# Altium schematic sheet [10] Peripheral.SchDoc: ARS Camera REV01 Peripherals (part 2 of 2)
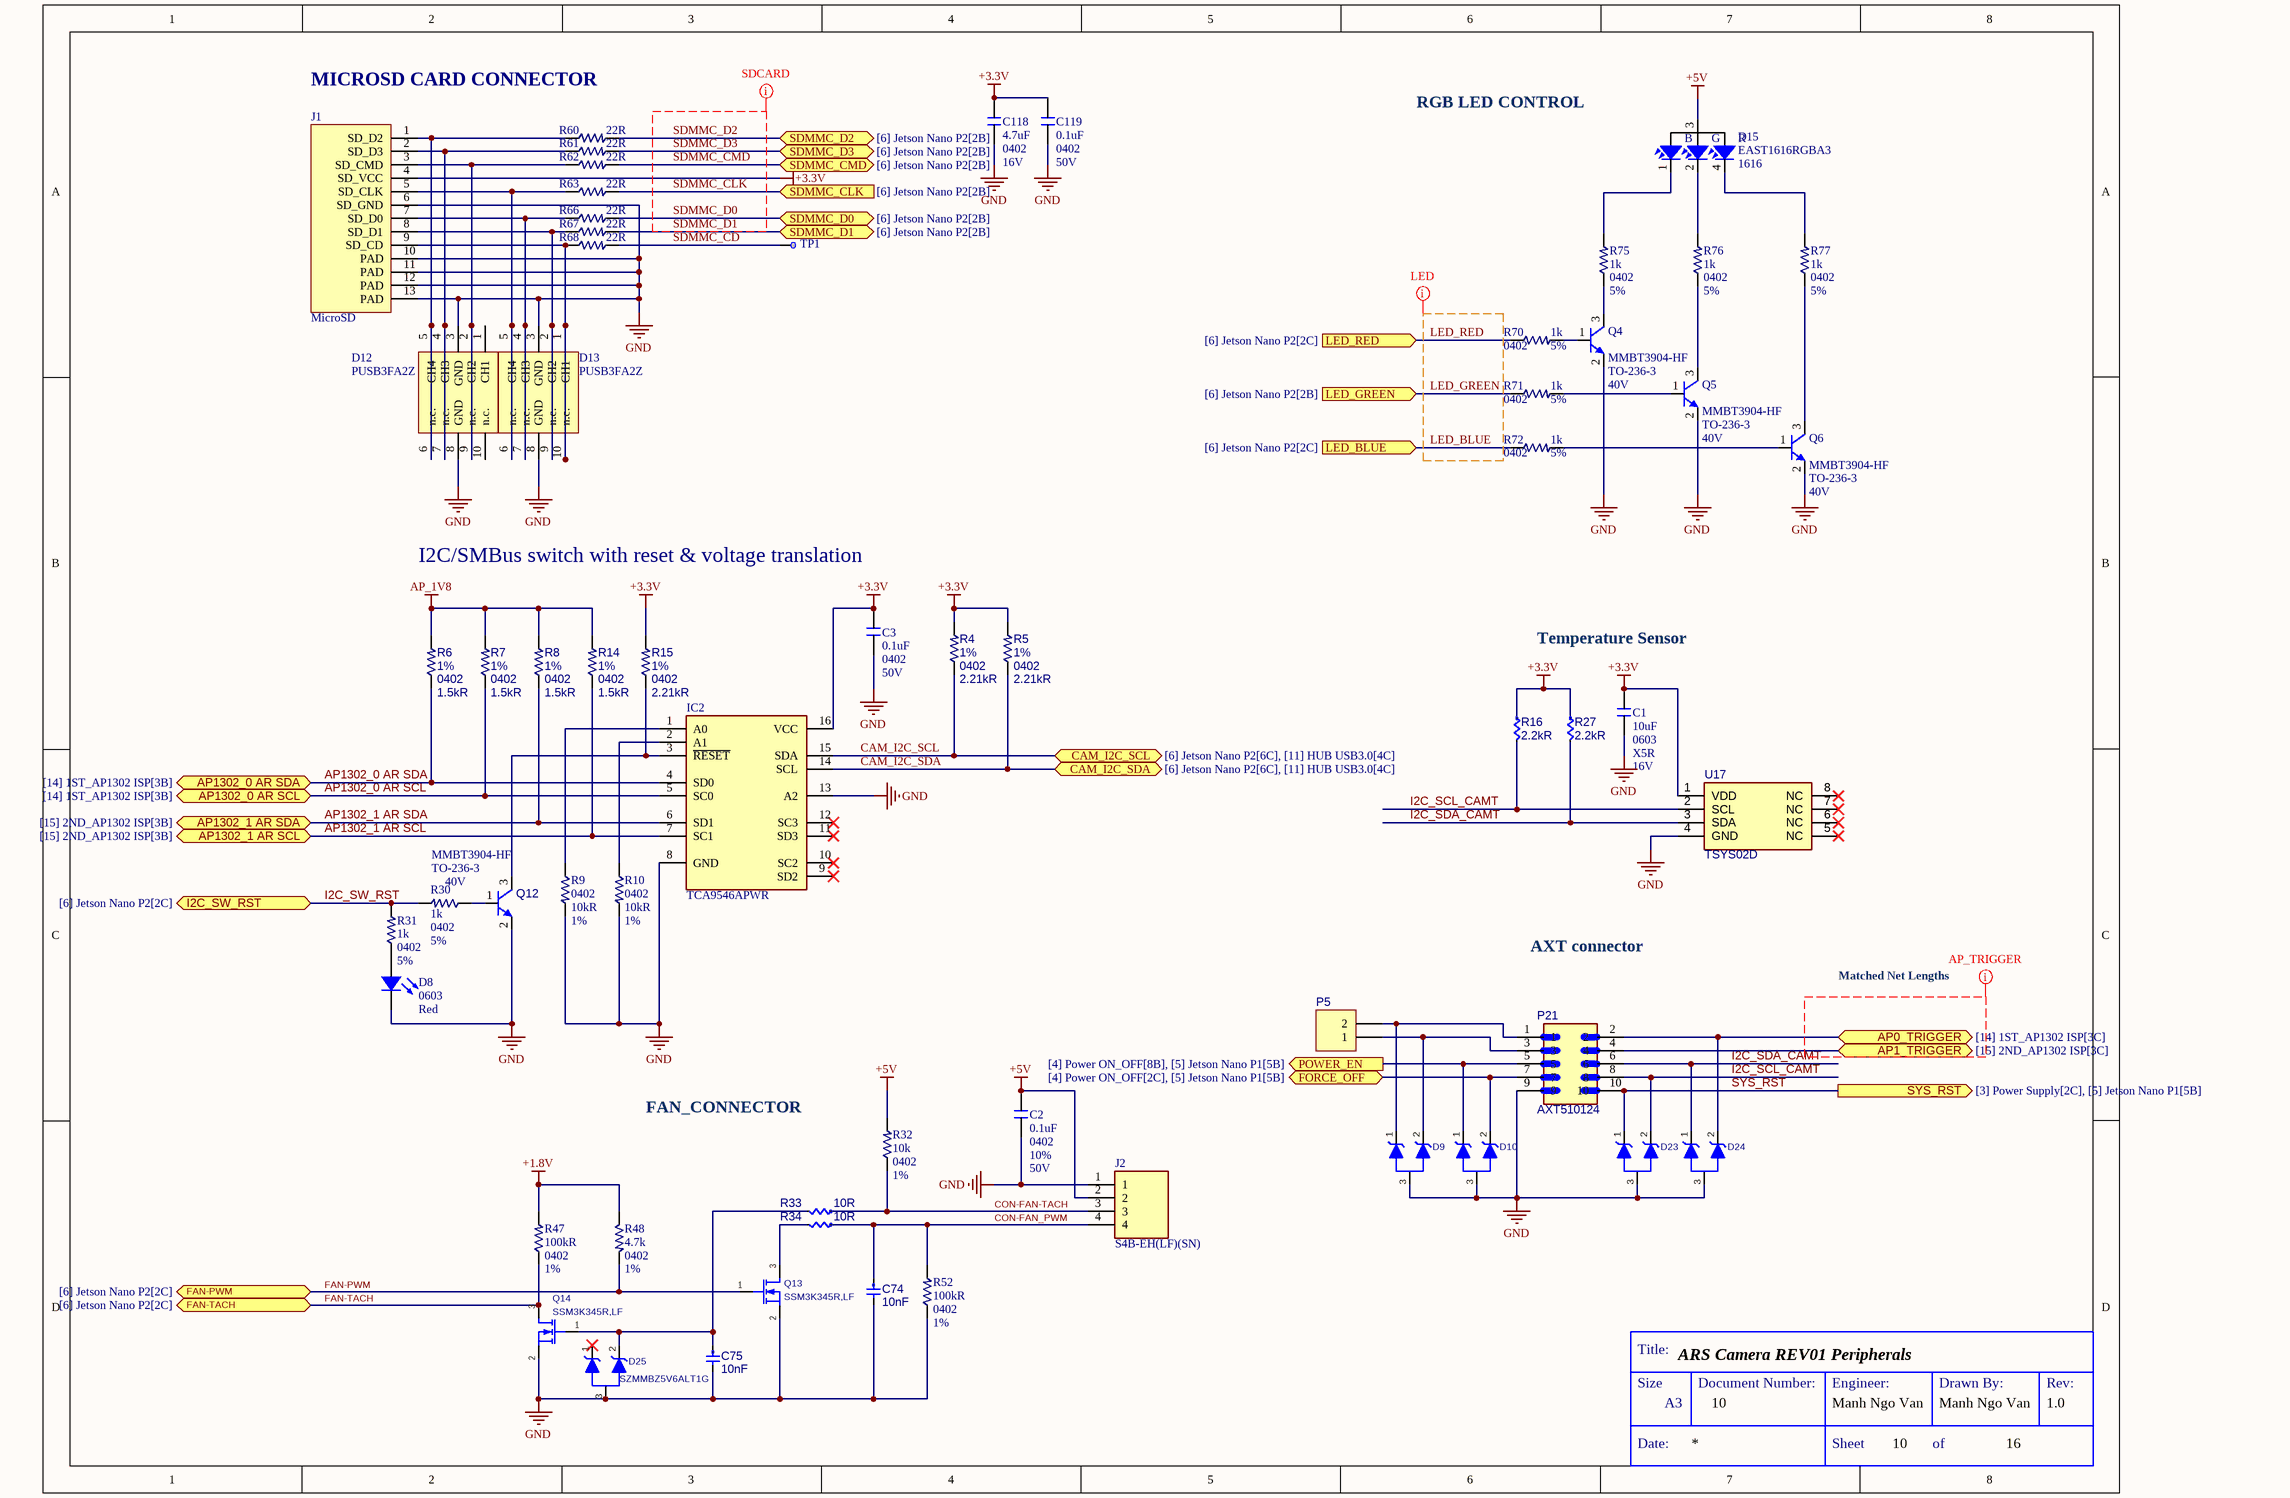
[diagram p1: [10] Peripheral.SchDoc]

## Library data of the parts
C1 = CAP_CER: CAP CER 10UF 16V X5R 0603; Manufacturer: Taiyo Yuden; Manufacturer Part Number: EMK107BBJ106MA-T; Tolerance: 20%; Supplier 1: Digi-Key; Supplier Part Number 1: 587-3238-1-ND; RoHS: Yes; Category: Ceramic Capacitors; Stock 1: 599529; Pricing 1: 1=0.34000, 10=0.23400, 50=0.16400, 100=0.14060, 500=0.10544, 1000=0.08903 (USD); Mount: Surface Mount; Case Code (Metric): 1608; Case Code (Imperial): 0603; Min Operating Temperature: -55°C; Max Operating Temperature: 85°C; Capacitance: 10uF; Packaging: Tape and Reel; Voltage Rating: 16V; Package Quantity: 1; Termination: SMD/SMT; Series: M; Construction: Flat; Length: 0.063inch; Width: 0.031inch; Height: 0.8mm; Thickness: 0.031inch; RoHS Compliant: Yes; REACH SVHC: Unknown; Halogen Free: Halogen Free; ComponentLink1URL: https://datasheet.ciiva.com/6259/emk107bbj106ma-t-6259169.pdf?src-supplier=Digi-Key; ComponentLink1Description: https://datasheet.ciiva.com/6259/emk107bbj106ma-t-6259169.pdf?src-supplier=Digi-Key; ComponentLink2URL: https://datasheet.ciiva.com/15920/3emk107bbj106ma-t-15920482.pdf?src-supplier=Onlinecomponents.com; ComponentLink2Description: https://datasheet.ciiva.com/15920/3emk107bbj106ma-t-15920482.pdf?src-supplier=Onlinecomponents.com; ComponentLink3URL: https://datasheet.ciiva.com/34372/463emk107bbj106ma-t-34372674.pdf?src-supplier=Onlinecomponents.com; ComponentLink3Description: https://datasheet.ciiva.com/34372/463emk107bbj106ma-t-34372674.pdf?src-supplier=Onlinecomponents.com; ComponentLink4URL: https://datasheet.ciiva.com/6259/emk107bbj106ma-t-6259164.pdf?src-supplier=Digi-Key; ComponentLink4Description: https://datasheet.ciiva.com/6259/emk107bbj106ma-t-6259164.pdf?src-supplier=Digi-Key; ComponentLink5URL: https://datasheet.ciiva.com/6259/emk107bbj106ma-t-6259167.pdf?src-supplier=Digi-Key; ComponentLink5Description: https://datasheet.ciiva.com/6259/emk107bbj106ma-t-6259167.pdf?src-supplier=Digi-Key; ComponentLink6URL: https://datasheet.ciiva.com/13168/mlcc01-e-13168735.pdf?src-supplier=Mouser; ComponentLink6Description: https://datasheet.ciiva.com/13168/mlcc01-e-13168735.pdf?src-supplier=Mouser
C2 = CAP_CER: CAP CER 0.1UF 50V X7R 0402; Manufacturer: Murata; Manufacturer Part Number: GRM155R71H104KE14D; Material: Ceramic; Capacitance: 100nF; Dissipation Factor: 0.025%; ComponentLink1URL: https://datasheet.ciiva.com/25741/cl10b104kb8nnnl-25741341.pdf?src-supplier=Digi-Key; ComponentLink1Description: https://datasheet.ciiva.com/25741/cl10b104kb8nnnl-25741341.pdf?src-supplier=Digi-Key; ComponentLink2URL: https://datasheet.ciiva.com/26838/getdatasheetpartid-357523-26838415.pdf?src-supplier=Verical; ComponentLink2Description: https://datasheet.ciiva.com/26838/getdatasheetpartid-357523-26838415.pdf?src-supplier=Verical; Supplier 1: Digi-Key; Supplier Part Number 1: 490-10700-1-ND; Stock 1: 2282266; Pricing 1: 1 = 0.10000, 10 = 0.04600, 100 = 0.02050, 500 = 0.01464, 1000 = 0.01150, 2500 = 0.01045, 5000 = 0.00961 (USD); RoHS: Yes; Mount: Surface Mount; Weight: 0.000212oz; Case Code (Metric): 1005; Case Code (Imperial): 0402; Dielectric Material: Ceramic; Min Operating Temperature: -55°C; Max Operating Temperature: 125°C; Packaging: Tape and Reel; Dielectric: X7R; Voltage Rating: 50V; Termination: SMD/SMT; Composition: Ceramic; Voltage Rating (DC): 50V; Package Quantity: 10000; Length: 1mm; Height: 0.5mm; Width: 0.5mm; Thickness: 0.022inch; Depth: 0.5mm; REACH SVHC: No SVHC; Lead Free: Lead Free; ComponentLink3URL: http://www.farnell.com/datasheets/2079156.pdf?src-supplier=Farnell; ComponentLink3Description: http://www.farnell.com/datasheets/2079156.pdf?src-supplier=Farnell; ComponentLink4URL: http://www.mouser.com/ds/2/281/c02e-2905.pdf?src-supplier=Mouser; ComponentLink4Description: http://www.mouser.com/ds/2/281/c02e-2905.pdf?src-supplier=Mouser; ComponentLink5URL: http://components.arrow.com/part/dataview/0323_07030614?src-supplier=Arrow+Europe; ComponentLink5Description: http://components.arrow.com/part/dataview/0323_07030614?src-supplier=Arrow+Europe; ComponentLink6URL: https://search.murata.co.jp/Ceramy/image/img/A01X/G101/ENG/GRM155R71H104KE14-01.pdf?src-supplier=Digi-Key; ComponentLink6Description: https://search.murata.co.jp/Ceramy/image/img/A01X/G101/ENG/GRM155R71H104KE14-01.pdf?src-supplier=Digi-Key; ComponentLink7URL: http://psearch.en.murata.com/capacitor/product/GRM155R71H104KE14%23.pdf?src-supplier=Avnet; ComponentLink7Description: http://psearch.en.murata.com/capacitor/product/GRM155R71H104KE14%23.pdf?src-supplier=Avnet; ComponentLink8URL: http://www.farnell.com/datasheets/2079156.pdf?src-supplier=Element14; ComponentLink8Description: http://www.farnell.com/datasheets/2079156.pdf?src-supplier=Element14; ComponentLink9URL: http://www.farnell.com/datasheets/2079156.pdf?src-supplier=Newark; ComponentLink9Description: http://www.farnell.com/datasheets/2079156.pdf?src-supplier=Newark
C3 C119 = CAP_CER: CAP CER 0.1UF 50V X7R 0402; Manufacturer: Murata; Manufacturer Part Number: GRM155R71H104KE14D; Material: Ceramic; Tolerance: 10%; Capacitance: 100nF; Dissipation Factor: 0.025%; ComponentLink1URL: https://datasheet.ciiva.com/25741/cl10b104kb8nnnl-25741341.pdf?src-supplier=Digi-Key; ComponentLink1Description: https://datasheet.ciiva.com/25741/cl10b104kb8nnnl-25741341.pdf?src-supplier=Digi-Key; ComponentLink2URL: https://datasheet.ciiva.com/26838/getdatasheetpartid-357523-26838415.pdf?src-supplier=Verical; ComponentLink2Description: https://datasheet.ciiva.com/26838/getdatasheetpartid-357523-26838415.pdf?src-supplier=Verical; Supplier 1: Digi-Key; Supplier Part Number 1: 490-10700-1-ND; Stock 1: 2282266; Pricing 1: 1 = 0.10000, 10 = 0.04600, 100 = 0.02050, 500 = 0.01464, 1000 = 0.01150, 2500 = 0.01045, 5000 = 0.00961 (USD); RoHS: Yes; Mount: Surface Mount; Weight: 0.000212oz; Case Code (Metric): 1005; Dielectric Material: Ceramic; Min Operating Temperature: -55°C; Max Operating Temperature: 125°C; Packaging: Tape and Reel; Dielectric: X7R; Voltage Rating: 50V; Termination: SMD/SMT; Composition: Ceramic; Voltage Rating (DC): 50V; Package Quantity: 10000; Length: 1mm; Height: 0.5mm; Width: 0.5mm; Thickness: 0.022inch; Depth: 0.5mm; REACH SVHC: No SVHC; Lead Free: Lead Free; ComponentLink3URL: http://www.farnell.com/datasheets/2079156.pdf?src-supplier=Farnell; ComponentLink3Description: http://www.farnell.com/datasheets/2079156.pdf?src-supplier=Farnell; ComponentLink4URL: http://www.mouser.com/ds/2/281/c02e-2905.pdf?src-supplier=Mouser; ComponentLink4Description: http://www.mouser.com/ds/2/281/c02e-2905.pdf?src-supplier=Mouser; ComponentLink5URL: http://components.arrow.com/part/dataview/0323_07030614?src-supplier=Arrow+Europe; ComponentLink5Description: http://components.arrow.com/part/dataview/0323_07030614?src-supplier=Arrow+Europe; ComponentLink6URL: https://search.murata.co.jp/Ceramy/image/img/A01X/G101/ENG/GRM155R71H104KE14-01.pdf?src-supplier=Digi-Key; ComponentLink6Description: https://search.murata.co.jp/Ceramy/image/img/A01X/G101/ENG/GRM155R71H104KE14-01.pdf?src-supplier=Digi-Key; ComponentLink7URL: http://psearch.en.murata.com/capacitor/product/GRM155R71H104KE14%23.pdf?src-supplier=Avnet; ComponentLink7Description: http://psearch.en.murata.com/capacitor/product/GRM155R71H104KE14%23.pdf?src-supplier=Avnet; ComponentLink8URL: http://www.farnell.com/datasheets/2079156.pdf?src-supplier=Element14; ComponentLink8Description: http://www.farnell.com/datasheets/2079156.pdf?src-supplier=Element14; ComponentLink9URL: http://www.farnell.com/datasheets/2079156.pdf?src-supplier=Newark; ComponentLink9Description: http://www.farnell.com/datasheets/2079156.pdf?src-supplier=Newark
  C3: Case Code (Imperial): 0402
  C119: Case/Package: 0402
C74 C75 = CMP-01521-1: CAP CER 10000PF 25V X7R 0402; Manufacturer 1: Würth Elektronik; Tolerance: 10%; RoHS Compliant: Yes; Thickness: 0.022inch; Case Code (Imperial): 0402; Length: 0.039inch; Width: 0.02inch; Mount: Surface Mount; Voltage Rating: 25V; Case/Package: 0402; Min Operating Temperature: -55°C; Max Operating Temperature: 125°C; Case Code (Metric): 1005; Manufacturer Part Number 1: 885012205050; Packaging: Tape and Reel
C118 = CAP_CER: CAP CER 4.7UF 16V X5R 0402; Manufacturer: Samsung; Manufacturer Part Number: CL05A475MO5NUNC; Tolerance: 20%; ComponentLink1URL: https://datasheet.ciiva.com/25786/cl05a475mp5nrnc-25786963.pdf?src-supplier=Digi-Key; ComponentLink1Description: https://datasheet.ciiva.com/25786/cl05a475mp5nrnc-25786963.pdf?src-supplier=Digi-Key; ComponentLink2URL: https://datasheet.ciiva.com/16437/cl05b104kq5nnnc-16437353.pdf?src-supplier=Future+Electronics; ComponentLink2Description: https://datasheet.ciiva.com/16437/cl05b104kq5nnnc-16437353.pdf?src-supplier=Future+Electronics; Supplier 1: Digi-Key; Supplier Part Number 1: 1276-6836-6-ND; Stock 1: 1677309; Pricing 1: 1 = 0.45000, 10 = 0.32100, 100 = 0.21130, 500 = 0.15656, 1000 = 0.13307, 2500 = 0.12524, 5000 = 0.11741 (USD); RoHS: Yes; Mount: Surface Mount; Case Code (Imperial): 0402; Case Code (Metric): 1005; Min Operating Temperature: -55°C; Max Operating Temperature: 85°C; Packaging: Tape and Reel; Capacitance: 4.7uF; Length: 0.039inch; Width: 0.02inch; Thickness: 0.022inch; ComponentLink3URL: http://www.farnell.com/datasheets/2710653.pdf?src-supplier=Farnell; ComponentLink3Description: http://www.farnell.com/datasheets/2710653.pdf?src-supplier=Farnell; ComponentLink4URL: http://www.farnell.com/datasheets/2710653.pdf?src-supplier=Newark; ComponentLink4Description: http://www.farnell.com/datasheets/2710653.pdf?src-supplier=Newark; ComponentLink5URL: http://www.samsungsem.com/kr/support/product-search/mlcc/CL05A475MO5NUNC.jsp?src-supplier=Digi-Key; ComponentLink5Description: http://www.samsungsem.com/kr/support/product-search/mlcc/CL05A475MO5NUNC.jsp?src-supplier=Digi-Key
D8 = Led: LED RED CLEAR CHIP SMD; Manufacturer 1: Vishay Lite-On; Lens Color: Colorless; Lens Style: Diffused,Colorless,Rectangular,Clear; Forward Voltage: 1.8V; Viewing Angle: 130°; Forward Current: 20mA; Luminous Intensity: 10mcd; Dominant Wavelength: 638nm; Test Current: 10mA; Number of Elements: 1; Power Dissipation: 62.5mW; Wavelength: 660nm; Reverse Voltage: 5V; Power Rating: 100mW; Supplier 1: Digi-Key; Supplier Part Number 1: 160-1181-1-ND; Manufacturer Part Number 1: LTST-C190CKT; RoHS: Yes; Category: LEDs; Stock 1: 143500; Pricing 1: 1=0.30000 (USD); Mount: Surface Mount; Number of Pins: 2; Case Code (Metric): 1608; Case Code (Imperial): 0603; Min Operating Temperature: -30°C; Max Operating Temperature: 85°C; Packaging: Tape and Reel; Package Quantity: 1; Illumination Color: Red; Lens Transparency: Clear; Number of LEDs: 1; Max Power Dissipation: 100mW; Length: 1.6mm; Width: 0.8mm; Height: 0.8mm; Depth: 0.8mm; Radiation Hardening: No; Lead Free: Lead Free; RoHS Compliant: Yes; ComponentLink1URL: https://datasheet.ciiva.com/2110/ltst-c190ckt-2110129.pdf?src-supplier=Digi-Key; ComponentLink1Description: https://datasheet.ciiva.com/2110/ltst-c190ckt-2110129.pdf?src-supplier=Digi-Key; ComponentLink2URL: https://datasheet.ciiva.com/15201/getdatasheetpartid-245581-15201387.pdf?src-supplier=Verical; ComponentLink2Description: https://datasheet.ciiva.com/15201/getdatasheetpartid-245581-15201387.pdf?src-supplier=Verical; ComponentLink3URL: https://datasheet.ciiva.com/11773/0900766b80dc029f-11773615.pdf?src-supplier=RSComponents; ComponentLink3Description: https://datasheet.ciiva.com/11773/0900766b80dc029f-11773615.pdf?src-supplier=RSComponents; ComponentLink4URL: https://datasheet.ciiva.com/12400/lite-on-ltst-c190ckt-187378-12400679.pdf?src-supplier=Mouser; ComponentLink4Description: https://datasheet.ciiva.com/12400/lite-on-ltst-c190ckt-187378-12400679.pdf?src-supplier=Mouser; ComponentLink5URL: https://datasheet.ciiva.com/16287/lite-on20ltst-c190ckt-16287002.pdf?src-supplier=Future+Electronics; ComponentLink5Description: https://datasheet.ciiva.com/16287/lite-on20ltst-c190ckt-16287002.pdf?src-supplier=Future+Electronics; ComponentLink6URL: https://datasheet.ciiva.com/2110/ltst-c190ckt-2110131.pdf?src-supplier=Digi-Key; ComponentLink6Description: https://datasheet.ciiva.com/2110/ltst-c190ckt-2110131.pdf?src-supplier=Digi-Key; ComponentLink7URL: https://datasheet.ciiva.com/2110/ltst-c190ckt-2110130.pdf?src-supplier=Digi-Key; ComponentLink7Description: https://datasheet.ciiva.com/2110/ltst-c190ckt-2110130.pdf?src-supplier=Digi-Key
D9 D10 D23-D25 = CMP-00699-1: TVS DIODE 3V 8V SOT23-3; Manufacturer 1: ON Semiconductor; Peak Pulse Power: 24W; Test Current: 20mA; Breakdown Voltage: 5.32V; ESD Protection: Yes; Number of Unidirectional Channels: 2; Element Configuration: Common Anode; Polarity: Unidirectional; Max Breakdown Voltage: 5.88V; Leakage Current: 5uA; Direction: Unidirectional,Bidirectional; Power Line Protection: No; Max Surge Current: 3A; Composition: Zener; Max Power Dissipation: 24W; Case/Package: SOT-23-3; Number of Pins: 3; Termination: SMD/SMT; Packaging: Tape and Reel; Min Operating Temperature: -55°C; Depth: 1.3mm; Number of Channels: 2; Reverse Standoff Voltage: 3V; Working Voltage: 3V; Manufacturer Part Number 1: SZMMBZ5V6ALT1G; Clamping Voltage: 8V; Max Reverse Leakage Current: 5uA; Lead Free: Lead Free; Power Dissipation: 24W; Height: 1.01mm; Width: 1.4mm; Min Breakdown Voltage: 5.32V; Package Quantity: 1; Radiation Hardening: No; Max Operating Temperature: 150°C; Operating Supply Voltage: 3V; Peak Pulse Current: 3A; Length: 2.9mm
D12 D13 = PUSB3FA2Z: ESD Suppressors / TVS Diodes PUSB3FA2 XSON10; Manufacturer 1: Nexperia; Supplier 1: Digi-Key; Manufacturer Part Number 1: PUSB3FA2Z; RoHS: No; Stock 1: 355; Pricing 1: 1=0.33000, 10=0.25600, 100=0.15390, 500=0.14250, 1000=0.09690, 2000=0.08921 (USD); ComponentLink1URL: https://assets.nexperia.com/documents/data-sheet/PUSB3FA2.pdf?src-supplier=Digi-Key; ComponentLink1Description: https://assets.nexperia.com/documents/data-sheet/PUSB3FA2.pdf?src-supplier=Digi-Key; Supplier Part Number 1: 1727-7813-1-ND
D15 = RGB LED: LED RGB CLEAR 4SMD; Manufacturer: Everlight; Color: Blue,Green,Red; Lens Color: Colorless; Lens Style: Flat; Element Configuration: Common Anode; Forward Voltage: 2.8V; Test Current: 5mA; Viewing Angle: 120°; Lens Size: 1.1mm; ComponentLink1URL: http://components.arrow.com/part/dataview/45774816S9812950N1331?src-supplier=Arrow+Electronics; ComponentLink1Description: http://components.arrow.com/part/dataview/45774816S9812950N1331?src-supplier=Arrow+Electronics; ComponentLink2URL: http://components.arrow.com/part/dataview/0323_04169278?src-supplier=Arrow+Europe; ComponentLink2Description: http://components.arrow.com/part/dataview/0323_04169278?src-supplier=Arrow+Europe; ComponentLink3URL: http://optoelectronics.liteon.com/ko-kr/api/DwonloadFileHandler.ashx?txtSpecNo=DS22-2005-062&txtPartNo=LTST-S310F3WT&src-supplier=Avnet; ComponentLink3Description: http://optoelectronics.liteon.com/ko-kr/api/DwonloadFileHandler.ashx?txtSpecNo=DS22-2005-062&txtPartNo=LTST-S310F3WT&src-supplier=Avnet; ComponentLink4URL: http://optoelectronics.liteon.com/en-us/product/detail.aspx?txtSpecNo=DS22-2005-062&txtPartNo=LTST-S310F3WT&src-supplier=Mouser; ComponentLink4Description: http://optoelectronics.liteon.com/en-us/product/detail.aspx?txtSpecNo=DS22-2005-062&txtPartNo=LTST-S310F3WT&src-supplier=Mouser; Supplier 1: Digi-Key; Supplier Part Number 1: 1080-1550-1-ND; Manufacturer Part Number: EAST1616RGBA3; Stock 1: 68555; Pricing 1: 1 = 0.47000, 10 = 0.28800, 100 = 0.16580, 1000 = 0.12974 (USD); RoHS: Yes; Mount: Surface Mount; Case/Package: 0606; Case Code (Imperial): 0606; Packaging: Cut Tape; Lens Transparency: Clear; Length: 1.6mm; Width: 1.6mm; Height: 0.45mm; Lead Free: Lead Free; RoHS Compliant: Yes; ComponentLink5URL: https://everlightamericas.com/index.php?controller=attachment&id_attachment=1010&src-supplier=Digi-Key; ComponentLink5Description: https://everlightamericas.com/index.php?controller=attachment&id_attachment=1010&src-supplier=Digi-Key
IC2 = TCA9546APWR: 4-channel 1.65- to 5.5-V I2C/SMBus switch with reset & voltage translation 16-TSSOP -40 to 85; Manufacturer 1: Texas Instruments; Supply Type: Single; Propagation Delay: 1ns; Independent Circuits: 1; Supplier 1: Digi-Key; Manufacturer Part Number 1: TCA9546APWR; Stock 1: 0; Pricing 1: 1=1.74000, 10=1.56500, 25=1.47600, 100=1.25760, 250=1.18084, 500=1.03324, 1000=0.97475 (USD); RoHS: Yes; Mount: Surface Mount; Case/Package: TSSOP; Number of Pins: 16; Weight: 0.006102oz; Contact Plating: Gold; Min Operating Temperature: -40°C; Max Operating Temperature: 85°C; Packaging: Cut Tape; Package Quantity: 2000; Series: TCA9546A; Lead Free: Lead Free; RoHS Compliant: Yes; ComponentLink1URL: http://www.ti.com/lit/ds/symlink/tca9546a.pdf?src-supplier=Digi-Key; ComponentLink1Description: http://www.ti.com/lit/ds/symlink/tca9546a.pdf?src-supplier=Digi-Key; ComponentLink2URL: http://www.ti.com/general/docs/lit/getliterature.tsp?genericPartNumber=TCA9546A&&fileType=pdf&src-supplier=Avnet; ComponentLink2Description: http://www.ti.com/general/docs/lit/getliterature.tsp?genericPartNumber=TCA9546A&&fileType=pdf&src-supplier=Avnet; ComponentLink3URL: http://www.ti.com/lit/gpn/tca9546a?src-supplier=Mouser; ComponentLink3Description: http://www.ti.com/lit/gpn/tca9546a?src-supplier=Mouser; ComponentLink4URL: http://www.ti.com/lit/ds/symlink/tca9546a.pdf?src-supplier=Farnell; ComponentLink4Description: http://www.ti.com/lit/ds/symlink/tca9546a.pdf?src-supplier=Farnell; ComponentLink5URL: http://www.ti.com/lit/ds/symlink/tca9546a.pdf?src-supplier=Newark; ComponentLink5Description: http://www.ti.com/lit/ds/symlink/tca9546a.pdf?src-supplier=Newark; Supplier Part Number 1: 296-40578-1-ND
J1 = uSD_TFv3: MICROSD TF PUSH CONNECTOR; Manufacturer: SHOU HAN; Manufacturer Part Number: TF PUSH; Supplier 1: LCSC; Supplier Part Number 1: C393941
J2 = S4B-EH_LF__SN_: CONN HEADER R/A 4POS 2.5MM; Manufacturer: JST; Supplier 1: Digi-Key; Supplier Part Number 1: 455-1627-ND; Manufacturer Part Number: S4B-EH(LF)(SN); RoHS: Yes; Category: Headers and Wire Housings; ComponentLink1URL: https://datasheet.ciiva.com/712/eeh-712458.pdf?src-supplier=Digi-Key; ComponentLink1Description: https://datasheet.ciiva.com/712/eeh-712458.pdf?src-supplier=Digi-Key
P5 = Header 2: CONN HEADER R/A 2POS 2.54MM; Manufacturer: Würth Elektronik GmbH; Manufacturer Part Number: 61300211021; Supplier 1: RSComponents; Supplier Part Number 1: 8281651
P21 = AXT510124: F4S Series 10 Position 0.4 mm Pitch Board to Board SMT Socket Connector; Manufacturer: Panasonic; Number of Positions: 10; Voltage Rating: 60V; Current Rating: 300mA; Max Voltage Rating (DC): 6.06kV; Contact Resistance: 90mR; Insulation Resistance: 1GR; Pitch: 0.4mm; Mated Stacking Heights: 1mm; Supplier 1: Digi-Key; Supplier Part Number 1: 255-2515-1-ND; Manufacturer Part Number: AXT510124; RoHS: Yes; Category: Board to Board Connectors; Stock 1: 14145; Pricing 1: 1=0.94000, 10=0.79400, 25=0.76160, 50=0.74520, 100=0.71280, 250=0.64800, 500=0.58320, 1000=0.51840 (USD); Mount: Surface Mount; Contact Plating: Gold; Contact Material: Copper Alloy; Housing Material: Polymer; Min Operating Temperature: -55°C; Max Operating Temperature: 85°C; Package Quantity: 1; Number of Rows: 2; Packaging: Tape and Reel; Connector Type: Socket; Termination: Solder; Number of Contacts: 10; Max Voltage Rating (AC): 60V; Orientation: Straight; Series: F4S; Length: 4.5mm; Depth: 3mm; Radiation Hardening: No; Lead Free: Lead Free; Flammability Rating: UL94 V-0; RoHS Compliant: Yes; ComponentLink1URL: https://datasheet.ciiva.com/393/con-eng-f4s-393360.pdf?src-supplier=Digi-Key; ComponentLink1Description: https://datasheet.ciiva.com/393/con-eng-f4s-393360.pdf?src-supplier=Digi-Key; ComponentLink2URL: https://datasheet.ciiva.com/9487/con-eng-f4s-9487568.pdf?src-supplier=Avnet; ComponentLink2Description: https://datasheet.ciiva.com/9487/con-eng-f4s-9487568.pdf?src-supplier=Avnet
Q4-Q6 Q12 = NPN: TRANS NPN 40V 0.2A SOT523; Manufacturer 1: Comchip; Collector Emitter Voltage (VCEO): 300mV; Max Collector Current: 200mA; Max Power Dissipation: 200mW; Transition Frequency: 300MHz; Element Configuration: Single; Collector Base Voltage (VCBO): 60V; Emitter Base Voltage (VEBO): 6V; Supplier 1: Digi-Key; Supplier Part Number 1: 641-1683-1-ND; Stock 1: 63354; Pricing 1: 1=0.19000, 10=0.17600, 100=0.09590, 500=0.05900, 1000=0.04023 (USD); RoHS: Yes; Mount: Surface Mount; Min Operating Temperature: -55°C; Max Operating Temperature: 150°C; Packaging: Tape and Reel; Package Quantity: 3000; Polarity: NPN; Collector Emitter Saturation Voltage: 300mV; Gain Bandwidth Product: 300MHz; Continuous Collector Current: 200mA; Collector-emitter Voltage-Max: 300mV; Series: -; Max Breakdown Voltage: 40V; RoHS Compliant: Yes; ComponentLink1URL: https://datasheet.ciiva.com/12075/mmbt3904-hf20reva265354-44540-12075939.pdf?src-supplier=Mouser; ComponentLink1Description: https://datasheet.ciiva.com/12075/mmbt3904-hf20reva265354-44540-12075939.pdf?src-supplier=Mouser; ComponentLink2URL: https://datasheet.ciiva.com/2957/mmbt3904-hf20reva265354-2957612.pdf?src-supplier=Digi-Key; ComponentLink2Description: https://datasheet.ciiva.com/2957/mmbt3904-hf20reva265354-2957612.pdf?src-supplier=Digi-Key
Q13 Q14 = CMP-00698-1: MOSFET N-CHANNEL 20V 4A SOT23F; Manufacturer 1: Toshiba Semiconductor and Storage; Manufacturer Part Number 1: SSM3K345R,LF
R4 R5 R15 = RES_SMD_2.21k: RES 2.21K OHM 1% 1/16W 0402; Manufacturer: Stackpole Electronics; Max Power Dissipation: 63mW; Temperature Coefficient: 100ppm/°C; Supplier 1: Digi-Key; Manufacturer Part Number: RMCF0402FT2K21; RoHS: Yes; Category: Chip SMD Resistors; Stock 1: 269570; Pricing 1: 1=0.10000, 10=0.01400, 100=0.00560, 1000=0.00253, 2500=0.00220, 5000=0.00181 (USD); Mount: Surface Mount; Case/Package: 0402; Case Code (Metric): 1005; Contact Plating: Tin,Matte; Min Operating Temperature: -55°C; Max Operating Temperature: 155°C; Packaging: Tape and Reel; Resistor Type: Thick Film; Number of Terminations: 2; Features: Automotive AEC-Q200; Series: RMCF; Construction: Rectangular; Length: 0.039inch; Width: 0.02inch; Height: 0.016inch; Depth: 0.5mm; Radiation Hardening: No; Military Standard: Not; RoHS Compliant: Yes; ComponentLink1URL: https://www.seielect.com/catalog/SEI-Packaging.pdf?src-supplier=Digi-Key; ComponentLink1Description: https://www.seielect.com/catalog/SEI-Packaging.pdf?src-supplier=Digi-Key; ComponentLink2URL: https://www.seielect.com/catalog/SEI-RMCF_RMCP.pdf?src-supplier=Avnet; ComponentLink2Description: https://www.seielect.com/catalog/SEI-RMCF_RMCP.pdf?src-supplier=Avnet; ComponentLink3URL: https://www.seielect.com/Catalog/SEI-RMCF_RMCP.pdf?src-supplier=Digi-Key; ComponentLink3Description: https://www.seielect.com/Catalog/SEI-RMCF_RMCP.pdf?src-supplier=Digi-Key; ComponentLink4URL: https://www.verical.com/server-webapp/html/getDatasheet?partID=413003&src-supplier=Verical; ComponentLink4Description: https://www.verical.com/server-webapp/html/getDatasheet?partID=413003&src-supplier=Verical; Supplier Part Number 1: RMCF0402FT2K21CT-ND
R6-R8 R14 = RES_SMD_1.5K: RES SMD 1.5K OHM 1% 1/16W 0402; Manufacturer: Yageo; Power Rating: 62.5mW; Voltage Rating: 50V; Max Power Dissipation: 63mW; Temperature Coefficient: 100ppm/°C; Supplier 1: Digi-Key; Manufacturer Part Number: AC0402FR-071K5L; RoHS: Yes; Category: Chip SMD Resistors; Stock 1: 632736; Pricing 1: 1=0.10000, 10=0.02000, 100=0.00830, 1000=0.00371, 2500=0.00322, 5000=0.00266 (USD); Mount: Surface Mount; Case Code (Imperial): 0402; Case Code (Metric): 1005; Size Code: 0402; Min Operating Temperature: -55°C; Max Operating Temperature: 155°C; Packaging: Tape and Reel; Resistor Type: Thick Film; Number of Terminations: 2; Termination: SMD/SMT; Features: Moisture Resistant,Automotive AEC-Q200; Series: AC; Length: 0.039inch; Width: 0.02inch; Height: 0.015inch; Lead Free: Lead Free; RoHS Compliant: Yes; ComponentLink1URL: http://www.mouser.com/ds/2/447/yageodocoutput-1111992.pdf?src-supplier=Mouser; ComponentLink1Description: http://www.mouser.com/ds/2/447/yageodocoutput-1111992.pdf?src-supplier=Mouser; ComponentLink2URL: http://www.yageo.com/documents/recent/PYu-AC_51_RoHS_L_2_revised.pdf?src-supplier=Future+Electronics; ComponentLink2Description: http://www.yageo.com/documents/recent/PYu-AC_51_RoHS_L_2_revised.pdf?src-supplier=Future+Electronics; ComponentLink3URL: http://www.yageo.com/NewPortal/yageodocoutput?fileName=/pdf/R-Chip/PYu-AC_51_RoHS_L_6.pdf&src-supplier=Digi-Key; ComponentLink3Description: http://www.yageo.com/NewPortal/yageodocoutput?fileName=/pdf/R-Chip/PYu-AC_51_RoHS_L_6.pdf&src-supplier=Digi-Key; Supplier Part Number 1: YAG3448CT-ND
R9 R10 = RES_SMD: RES SMD 10K OHM 1% 1/16W 0402; Manufacturer 1: Yageo; Temperature Coefficient: 100ppm/°C; Voltage Rating (DC): 50V; Power Rating: 62.5mW; Max Power Dissipation: 63mW; Supplier 1: RSComponents; Supplier Part Number 1: 1987643; Manufacturer Part Number 1: RC0402FR-0710KL; Stock 1: 29900; Pricing 1: 10000=0.00300 (GBP); RoHS: Yes; Case/Package: 0402; Number of Pins: 2; Case Code (Metric): 1005; Min Operating Temperature: -55°C; Max Operating Temperature: 155°C; Resistor Type: Thick Film; Tolerance: 1%; Packaging: Tape and Reel; Voltage Rating: 50V; Termination: SMD/SMT; Working Voltage: 50V; Number of Terminations: 2; Features: Moisture Resistant; Series: RC; Construction: Rectangular; Length: 1mm; Width: 0.5mm; Height: 0.32mm; Depth: 0.5mm; Lead Pitch: 0.2mm; REACH SVHC: No SVHC; Lead Free: Lead Free; RoHS Compliant: Yes; Military Standard: Not; ComponentLink1URL: https://datasheet.ciiva.com/7660/38568-7660787.pdf?src-supplier=Element14; ComponentLink1Description: https://datasheet.ciiva.com/7660/38568-7660787.pdf?src-supplier=Element14; ComponentLink2URL: https://datasheet.ciiva.com/7849/1784430-7849813.pdf?src-supplier=Element14; ComponentLink2Description: https://datasheet.ciiva.com/7849/1784430-7849813.pdf?src-supplier=Element14; ComponentLink3URL: https://datasheet.ciiva.com/7849/1686128-7849814.pdf?src-supplier=Element14; ComponentLink3Description: https://datasheet.ciiva.com/7849/1686128-7849814.pdf?src-supplier=Element14; ComponentLink4URL: https://datasheet.ciiva.com/7849/1784430-7849815.pdf?src-supplier=Element14; ComponentLink4Description: https://datasheet.ciiva.com/7849/1784430-7849815.pdf?src-supplier=Element14; ComponentLink5URL: https://datasheet.ciiva.com/22747/1018594-22747512.pdf?src-supplier=Element14; ComponentLink5Description: https://datasheet.ciiva.com/22747/1018594-22747512.pdf?src-supplier=Element14; ComponentLink6URL: https://datasheet.ciiva.com/12667/pyu-rc0402-51-rohs-l-6-r-12667067.pdf?src-supplier=Mouser; ComponentLink6Description: https://datasheet.ciiva.com/12667/pyu-rc0402-51-rohs-l-6-r-12667067.pdf?src-supplier=Mouser; ComponentLink7URL: https://datasheet.ciiva.com/7983/1018594-7983486.pdf?src-supplier=Element14; ComponentLink7Description: https://datasheet.ciiva.com/7983/1018594-7983486.pdf?src-supplier=Element14
R16 R27 = CMP-01651-2: RES SMD 2.2K OHM 1% 1/16W 0402; Manufacturer: Yageo; Voltage Rating: 50V; Power Rating: 63mW; Temperature Coefficient: 100ppm/°C; Manufacturer Part Number 1: RC0402FR-072K2L; Packaging: Tape and Reel; Case Code (Metric): 1005; Termination: SMD/SMT; REACH SVHC: Unknown; Lead Free: Lead Free; Number of Pins: 2; Manufacturer 1: Yageo; Case/Package: 0402; Max Operating Temperature: 155°C; Height: 0.35mm; Manufacturer Part Number: RC0402FR-072K2L; Voltage Rating (DC): 50V; Working Voltage: 50V; Lead Pitch: 0.2mm; Number of Terminations: 2; Min Operating Temperature: -55°C; Tolerance: 1%; Length: 1mm; Width: 0.5mm; Case Code (Imperial): 0402; Composition: Thick Film; Military Standard: Not; Depth: 0.5mm
R30 R31 R70-R72 R75-R77 = RES_SMD: RES SMD 1K OHM 5% 1/16W 0402; Manufacturer: Yageo; Manufacturer Part Number: RC0402JR-071KL; Resistance: 1kR; Power Rating: 62.5mW; Voltage Rating: 50V; Temperature Coefficient: 100ppm/°C; Max Power Dissipation: 63mW; ComponentLink1URL: https://datasheet.ciiva.com/16855/pyu-rc0201-51-rohs-l-8-16855270.pdf?src-supplier=Avnet+Europe; ComponentLink1Description: https://datasheet.ciiva.com/16855/pyu-rc0201-51-rohs-l-8-16855270.pdf?src-supplier=Avnet+Europe; ComponentLink2URL: https://datasheet.ciiva.com/7672/1563626-7672265.pdf?src-supplier=Element14; ComponentLink2Description: https://datasheet.ciiva.com/7672/1563626-7672265.pdf?src-supplier=Element14; ComponentLink3URL: https://datasheet.ciiva.com/7660/1421516-7660811.pdf?src-supplier=Element14; ComponentLink3Description: https://datasheet.ciiva.com/7660/1421516-7660811.pdf?src-supplier=Element14; ComponentLink4URL: https://datasheet.ciiva.com/46391/1421516-46391293.pdf?src-supplier=Element14; ComponentLink4Description: https://datasheet.ciiva.com/46391/1421516-46391293.pdf?src-supplier=Element14; ComponentLink5URL: https://datasheet.ciiva.com/2462/pyu-r-int-thick-7-2462830.pdf?src-supplier=Digi-Key; ComponentLink5Description: https://datasheet.ciiva.com/2462/pyu-r-int-thick-7-2462830.pdf?src-supplier=Digi-Key; ComponentLink6URL: https://datasheet.ciiva.com/2462/pyu-r-int-thick-7-2462831.pdf?src-supplier=Digi-Key; ComponentLink6Description: https://datasheet.ciiva.com/2462/pyu-r-int-thick-7-2462831.pdf?src-supplier=Digi-Key; ComponentLink7URL: https://datasheet.ciiva.com/8896/pyu-rc0201-51-rohs-l-8-8896175.pdf?src-supplier=Avnet; ComponentLink7Description: https://datasheet.ciiva.com/8896/pyu-rc0201-51-rohs-l-8-8896175.pdf?src-supplier=Avnet; ComponentLink8URL: https://datasheet.ciiva.com/28419/pyu-rc0201-51-rohs-l-8-28419638.pdf?src-supplier=Avnet+Europe; ComponentLink8Description: https://datasheet.ciiva.com/28419/pyu-rc0201-51-rohs-l-8-28419638.pdf?src-supplier=Avnet+Europe; ComponentLink9URL: https://datasheet.ciiva.com/7672/1563626-7672264.pdf?src-supplier=Element14; ComponentLink9Description: https://datasheet.ciiva.com/7672/1563626-7672264.pdf?src-supplier=Element14; ComponentLink10URL: https://datasheet.ciiva.com/2462/pyu-r-int-thick-7-2462829.pdf?src-supplier=Digi-Key; ComponentLink10Description: https://datasheet.ciiva.com/2462/pyu-r-int-thick-7-2462829.pdf?src-supplier=Digi-Key; Supplier 1: Digi-Key; Supplier Part Number 1: 311-1.0KJRCT-ND; Stock 1: 0; Pricing 1: 1 = 0.10000, 10 = 0.01300, 100 = 0.00530, 1000 = 0.00236, 2500 = 0.00205, 5000 = 0.00169 (USD); RoHS: Yes; Case/Package: 0402; Case Code (Metric): 1005; Min Operating Temperature: -55°C; Max Operating Temperature: 155°C; Packaging: Tape and Reel; Package Quantity: 1; Termination: SMD/SMT; Composition: Thick Film; Number of Terminations: 2; Military Standard: Not; Features: Moisture Resistant; Length: 0.039inch; Height: 0.016inch; Width: 0.02inch; Depth: 0.5mm; REACH SVHC: No SVHC; Lead Free: Lead Free; ComponentLink11URL: https://datasheet.ciiva.com/2452/pyu-r-int-thick-7-2452755.pdf?src-supplier=Digi-Key; ComponentLink11Description: https://datasheet.ciiva.com/2452/pyu-r-int-thick-7-2452755.pdf?src-supplier=Digi-Key; ComponentLink12URL: https://datasheet.ciiva.com/2452/pyu-r-int-thick-7-2452756.pdf?src-supplier=Digi-Key; ComponentLink12Description: https://datasheet.ciiva.com/2452/pyu-r-int-thick-7-2452756.pdf?src-supplier=Digi-Key; ComponentLink13URL: https://datasheet.ciiva.com/2452/pyu-r-int-thick-7-2452757.pdf?src-supplier=Digi-Key; ComponentLink13Description: https://datasheet.ciiva.com/2452/pyu-r-int-thick-7-2452757.pdf?src-supplier=Digi-Key; ComponentLink14URL: https://datasheet.ciiva.com/7983/1018594-7983558.pdf?src-supplier=Element14; ComponentLink14Description: https://datasheet.ciiva.com/7983/1018594-7983558.pdf?src-supplier=Element14; ComponentLink15URL: https://datasheet.ciiva.com/7850/1018594-7850170.pdf?src-supplier=Element14; ComponentLink15Description: https://datasheet.ciiva.com/7850/1018594-7850170.pdf?src-supplier=Element14; ComponentLink16URL: https://datasheet.ciiva.com/7850/1018594-7850171.pdf?src-supplier=Element14; ComponentLink16Description: https://datasheet.ciiva.com/7850/1018594-7850171.pdf?src-supplier=Element14; ComponentLink17URL: https://datasheet.ciiva.com/17081/pyu-rc0402-51-rohs-l-6-r-17081438.pdf?src-supplier=Future+Electronics; ComponentLink17Description: https://datasheet.ciiva.com/17081/pyu-rc0402-51-rohs-l-6-r-17081438.pdf?src-supplier=Future+Electronics
R32 = RES_SMD: RES SMD 10K OHM 1% 1/16W 0402; Manufacturer: Yageo; Manufacturer Part Number: RC0402FR-0710KL; Resistance: 10kR; Temperature Coefficient: 100ppm/°C; Voltage Rating (DC): 50V; Power Rating: 62.5mW; Supplier 1: Digi-Key; Supplier Part Number 1: 311-10.0KLRTR-ND; Stock 1: 58760000; Pricing 1: 10000 = 0.001630, 30000 = 0.001440, 50000 = 0.001320, 100000 = 0.001290 (USD); RoHS: Yes; Case/Package: 0402; Number of Pins: 2; Case Code (Metric): 1005; Min Operating Temperature: -55°C; Max Operating Temperature: 155°C; Composition: Thick Film; Packaging: Tape and Reel; Voltage Rating: 50V; Termination: SMD/SMT; Military Standard: Not; Working Voltage: 50V; Number of Terminations: 2; Length: 1mm; Height: 0.32mm; Width: 0.5mm; Depth: 0.5mm; Lead Pitch: 0.2mm; REACH SVHC: No SVHC; Lead Free: Lead Free; ComponentLink1URL: https://datasheet.ciiva.com/7660/38568-7660787.pdf?src-supplier=Element14; ComponentLink1Description: https://datasheet.ciiva.com/7660/38568-7660787.pdf?src-supplier=Element14; ComponentLink2URL: https://datasheet.ciiva.com/7849/1784430-7849813.pdf?src-supplier=Element14; ComponentLink2Description: https://datasheet.ciiva.com/7849/1784430-7849813.pdf?src-supplier=Element14; ComponentLink3URL: https://datasheet.ciiva.com/7849/1686128-7849814.pdf?src-supplier=Element14; ComponentLink3Description: https://datasheet.ciiva.com/7849/1686128-7849814.pdf?src-supplier=Element14; ComponentLink4URL: https://datasheet.ciiva.com/7849/1784430-7849815.pdf?src-supplier=Element14; ComponentLink4Description: https://datasheet.ciiva.com/7849/1784430-7849815.pdf?src-supplier=Element14; ComponentLink5URL: https://datasheet.ciiva.com/22747/1018594-22747512.pdf?src-supplier=Element14; ComponentLink5Description: https://datasheet.ciiva.com/22747/1018594-22747512.pdf?src-supplier=Element14; ComponentLink6URL: https://datasheet.ciiva.com/12667/pyu-rc0402-51-rohs-l-6-r-12667067.pdf?src-supplier=Mouser; ComponentLink6Description: https://datasheet.ciiva.com/12667/pyu-rc0402-51-rohs-l-6-r-12667067.pdf?src-supplier=Mouser; ComponentLink7URL: https://datasheet.ciiva.com/7983/1018594-7983486.pdf?src-supplier=Element14; ComponentLink7Description: https://datasheet.ciiva.com/7983/1018594-7983486.pdf?src-supplier=Element14
R33 R34 = CMP-00792-3: RES 10 OHM 1% 1/4W 0805; Manufacturer 1: Stackpole Electronics Inc; Temperature Coefficient: 100ppm/°C; Max Power Dissipation: 250mW; Min Operating Temperature: -55°C; Composition: Thin Film; Case Code (Metric): 2012; Manufacturer Part Number 1: RNCP0805FTD10R0; Case Code (Imperial): 0805; Max Operating Temperature: 155°C; Height: 0.024inch; Length: 0.079inch; Tolerance: 1%; Number of Terminations: 2; Width: 0.049inch; Packaging: Tape and Reel; Case/Package: 0805; Features: Moisture Resistant,Anti-Sulfur; Mount: Surface Mount
R47 R52 = RES_SMD: 贴片电阻 100000Ω ± 1.00% 0.0625W ± 100ppm/℃ 0402; Manufacturer 1: Yageo; Manufacturer Part Number 1: RC0402FR-07100KL; Temperature Coefficient: 100ppm/°C; Power Rating: 63mW; Voltage Rating: 50V; Supplier 1: Newark; Supplier Part Number 1: 66R1125; Stock 1: 2470000; Pricing 1: 1=0.00500, 5000=0.00400, 10000=0.00300 (USD); RoHS: Yes; Case Code (Metric): 1005; Case Code (Imperial): 0402; Min Operating Temperature: -55°C; Max Operating Temperature: 155°C; Resistor Type: Thick Film; Resistance: 100kR; Packaging: Tape and Reel; Package Quantity: 1; Number of Terminations: 2; Termination: SMD/SMT; Max Power Dissipation: 63mW; Working Voltage: 50V; Features: Moisture Resistant; Series: RC; Resistance Tolerance: 1%; Construction: Rectangular; Technology: THICK FILM; Length: 0.039inch; Width: 0.02inch; Height: 0.016inch; Depth: 0.5mm; REACH SVHC: No SVHC; Lead Free: Lead Free; RoHS Compliant: Yes; Military Standard: Not; ComponentLink1URL: https://datasheet.ciiva.com/11819/0900766b80c66297-11819452.pdf?src-supplier=RSComponents; ComponentLink1Description: https://datasheet.ciiva.com/11819/0900766b80c66297-11819452.pdf?src-supplier=RSComponents; ComponentLink2URL: https://datasheet.ciiva.com/22747/1018594-22747509.pdf?src-supplier=Element14; ComponentLink2Description: https://datasheet.ciiva.com/22747/1018594-22747509.pdf?src-supplier=Element14; ComponentLink3URL: https://datasheet.ciiva.com/2453/pyu-r-int-thick-7-2453362.pdf?src-supplier=Digi-Key; ComponentLink3Description: https://datasheet.ciiva.com/2453/pyu-r-int-thick-7-2453362.pdf?src-supplier=Digi-Key; ComponentLink4URL: https://datasheet.ciiva.com/2453/pyu-r-int-thick-7-2453363.pdf?src-supplier=Digi-Key; ComponentLink4Description: https://datasheet.ciiva.com/2453/pyu-r-int-thick-7-2453363.pdf?src-supplier=Digi-Key; ComponentLink5URL: https://datasheet.ciiva.com/2453/pyu-r-int-thick-7-2453361.pdf?src-supplier=Digi-Key; ComponentLink5Description: https://datasheet.ciiva.com/2453/pyu-r-int-thick-7-2453361.pdf?src-supplier=Digi-Key; ComponentLink6URL: https://datasheet.ciiva.com/12667/pyu-rc0402-51-rohs-l-6-r-12667930.pdf?src-supplier=Mouser; ComponentLink6Description: https://datasheet.ciiva.com/12667/pyu-rc0402-51-rohs-l-6-r-12667930.pdf?src-supplier=Mouser; ComponentLink7URL: https://datasheet.ciiva.com/15189/getdatasheetpartid-323696-15189334.pdf?src-supplier=Verical; ComponentLink7Description: https://datasheet.ciiva.com/15189/getdatasheetpartid-323696-15189334.pdf?src-supplier=Verical
R48 = RES_SMD: RES SMD 4.7K OHM 1% 1/16W 0402; Manufacturer: Yageo; Manufacturer Part Number: RC0402FR-074K7L; Voltage Rating (DC): 50V; Power Rating: 62.5mW; Resistance: 4.7kR; Temperature Coefficient: 100ppm/°C; Supplier 1: Digi-Key; Supplier Part Number 1: 311-4.7KLRCT-ND; Stock 1: 10584879; Pricing 1: 1 = 0.10000, 10 = 0.01400, 100 = 0.00580, 1000 = 0.00260, 2500 = 0.00226, 5000 = 0.00186 (USD); RoHS: Yes; Case/Package: 0402; Number of Pins: 2; Case Code (Metric): 1005; Min Operating Temperature: -55°C; Max Operating Temperature: 155°C; Voltage Rating: 50V; Packaging: Tape and Reel; Resistor Type: Thick Film; Termination: SMD/SMT; Length: 1mm; Width: 0.5mm; Height: 0.32mm; Depth: 0.5mm; REACH SVHC: No SVHC; Military Standard: Not; Lead Free: Lead Free; ComponentLink1URL: https://datasheet.ciiva.com/7850/1018594-7850022.pdf?src-supplier=Element14; ComponentLink1Description: https://datasheet.ciiva.com/7850/1018594-7850022.pdf?src-supplier=Element14; ComponentLink2URL: https://datasheet.ciiva.com/7850/1018594-7850023.pdf?src-supplier=Element14; ComponentLink2Description: https://datasheet.ciiva.com/7850/1018594-7850023.pdf?src-supplier=Element14; ComponentLink3URL: https://datasheet.ciiva.com/15215/getdatasheetpartid-328119-15215035.pdf?src-supplier=Verical; ComponentLink3Description: https://datasheet.ciiva.com/15215/getdatasheetpartid-328119-15215035.pdf?src-supplier=Verical; ComponentLink4URL: https://datasheet.ciiva.com/22661/1686128-22661342.pdf?src-supplier=Element14; ComponentLink4Description: https://datasheet.ciiva.com/22661/1686128-22661342.pdf?src-supplier=Element14
R60-R63 R66-R68 = RES_SMD: RES SMD 22R OHM 5% 1/16W 0402; Manufacturer: Yageo; Manufacturer Part Number: RC0402JR-0722RL; Temperature Coefficient: 100ppm/°C; Power Rating: 62.5mW; Voltage Rating: 50V; Max Power Dissipation: 63mW; Supplier 1: Digi-Key; Supplier Part Number 1: 311-22JRCT-ND; Stock 1: 28; Pricing 1: 1 = 0.10000, 10 = 0.01300, 100 = 0.00530, 1000 = 0.00236, 2500 = 0.00205, 5000 = 0.00169 (USD); RoHS: Yes; Case/Package: 0402; Case Code (Metric): 1005; Case Code (Imperial): 0402; Min Operating Temperature: -55°C; Max Operating Temperature: 155°C; Tolerance: 5%; Resistance: 22R; Packaging: Tape and Reel; Package Quantity: 1; Composition: Thick Film; Number of Terminations: 2; Termination: SMD/SMT; Military Standard: Not; Features: Moisture Resistant; Length: 0.039inch; Height: 0.016inch; Width: 0.02inch; Depth: 0.5mm; REACH SVHC: No SVHC; Lead Free: Lead Free; ComponentLink1URL: https://datasheet.ciiva.com/2452/pyu-r-int-thick-7-2452770.pdf?src-supplier=Digi-Key; ComponentLink1Description: https://datasheet.ciiva.com/2452/pyu-r-int-thick-7-2452770.pdf?src-supplier=Digi-Key; ComponentLink2URL: https://datasheet.ciiva.com/2452/pyu-r-int-thick-7-2452771.pdf?src-supplier=Digi-Key; ComponentLink2Description: https://datasheet.ciiva.com/2452/pyu-r-int-thick-7-2452771.pdf?src-supplier=Digi-Key; ComponentLink3URL: https://datasheet.ciiva.com/2452/pyu-r-int-thick-7-2452772.pdf?src-supplier=Digi-Key; ComponentLink3Description: https://datasheet.ciiva.com/2452/pyu-r-int-thick-7-2452772.pdf?src-supplier=Digi-Key; ComponentLink4URL: https://datasheet.ciiva.com/7850/1018594-7850181.pdf?src-supplier=Element14; ComponentLink4Description: https://datasheet.ciiva.com/7850/1018594-7850181.pdf?src-supplier=Element14; ComponentLink5URL: https://datasheet.ciiva.com/46394/1018594-46394972.pdf?src-supplier=Element14; ComponentLink5Description: https://datasheet.ciiva.com/46394/1018594-46394972.pdf?src-supplier=Element14; ComponentLink6URL: https://datasheet.ciiva.com/12656/pyu-rc0402-51-rohs-l-6-r-12656926.pdf?src-supplier=Mouser; ComponentLink6Description: https://datasheet.ciiva.com/12656/pyu-rc0402-51-rohs-l-6-r-12656926.pdf?src-supplier=Mouser
TP1 = TestPoint
U17 = TSYS02D: Temperature Sensor, 1DEG C, TDFN-8; Manufacturer: TE Connectivity; Supplier 1: Mouser; Manufacturer Part Number: TSYS02D; RoHS: Yes; Category: Sensors; Pricing 1: 1=3.43000, 10=2.11000, 50=2.11000, 100=2.00000, 1000=1.58000, 10000=1.58000 (USD); RoHS Compliant: Yes; Supplier Part Number 1: 824-TSYS02D